# EAGLE board Main board V6.0 (EAGLE 6.5.0)
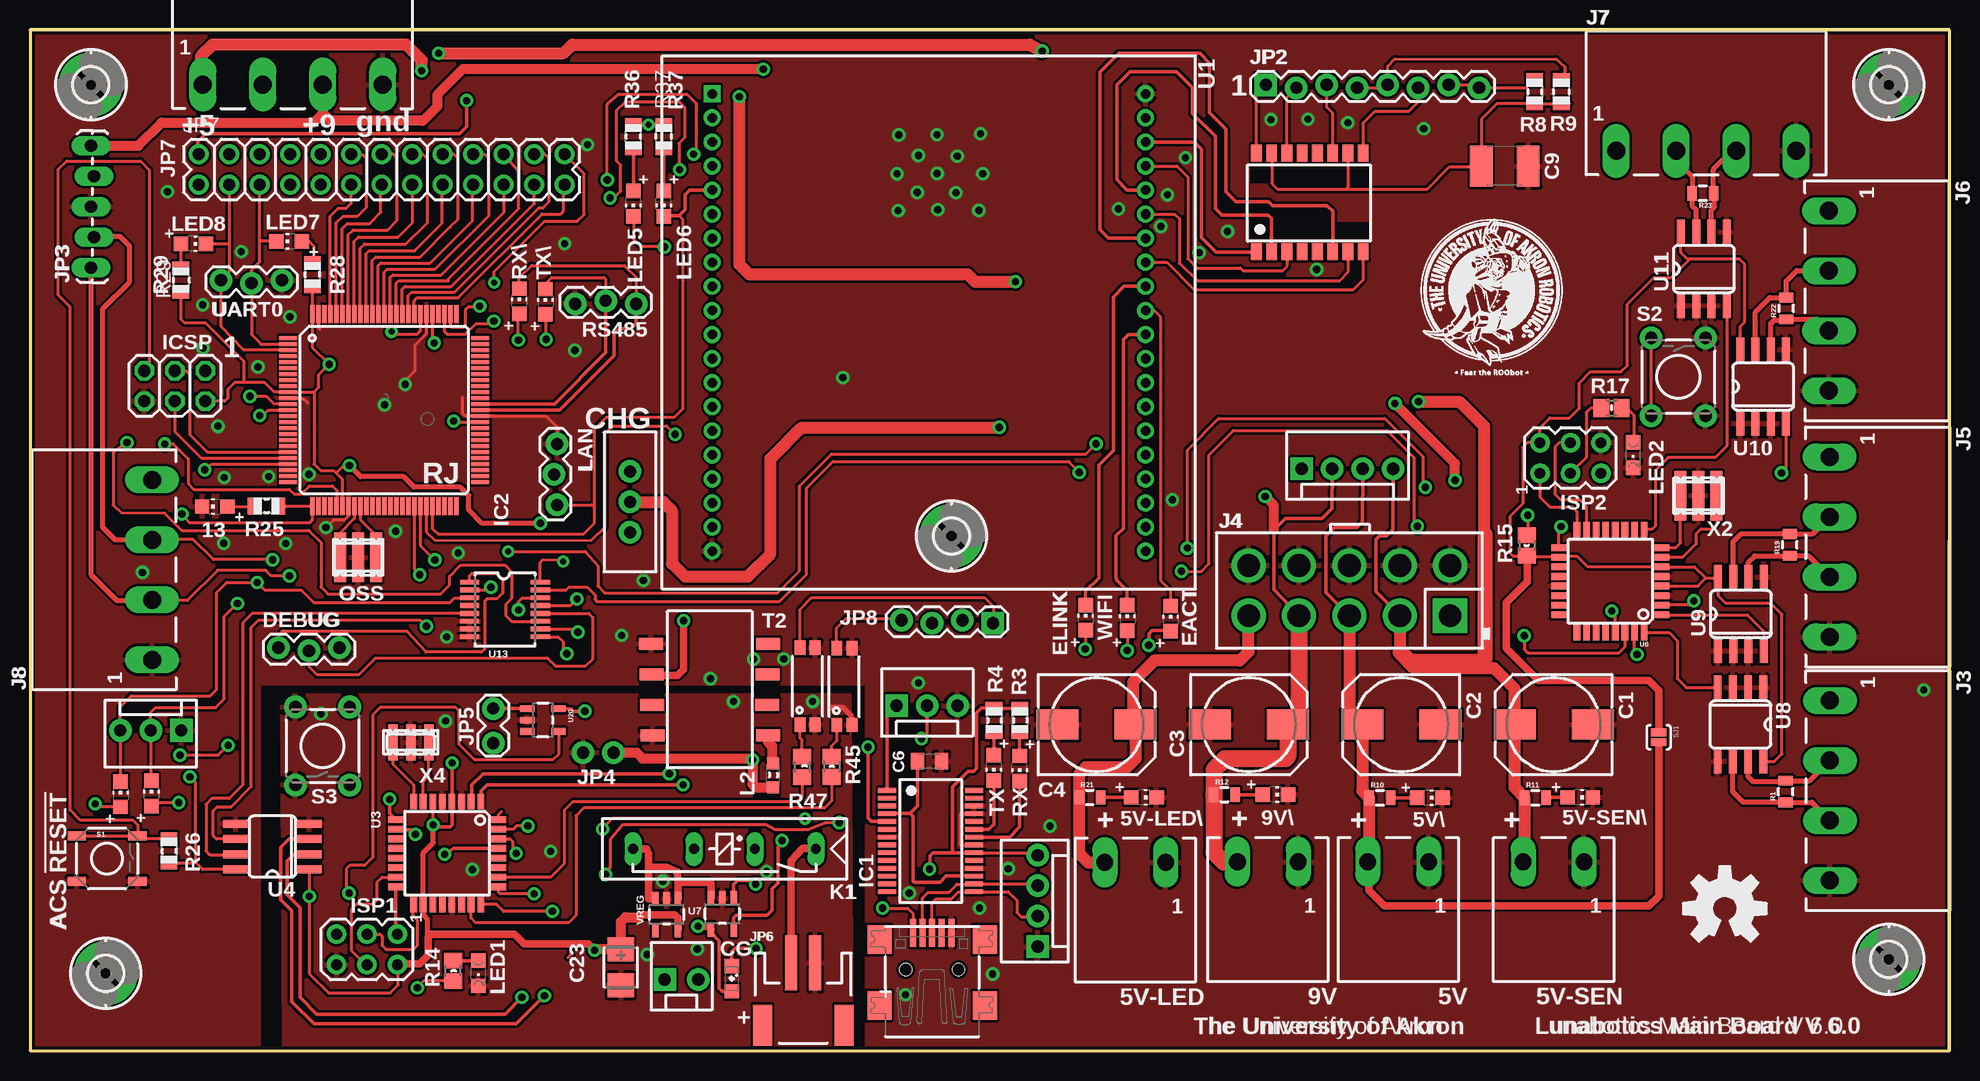
[diagram p5: board, top side]
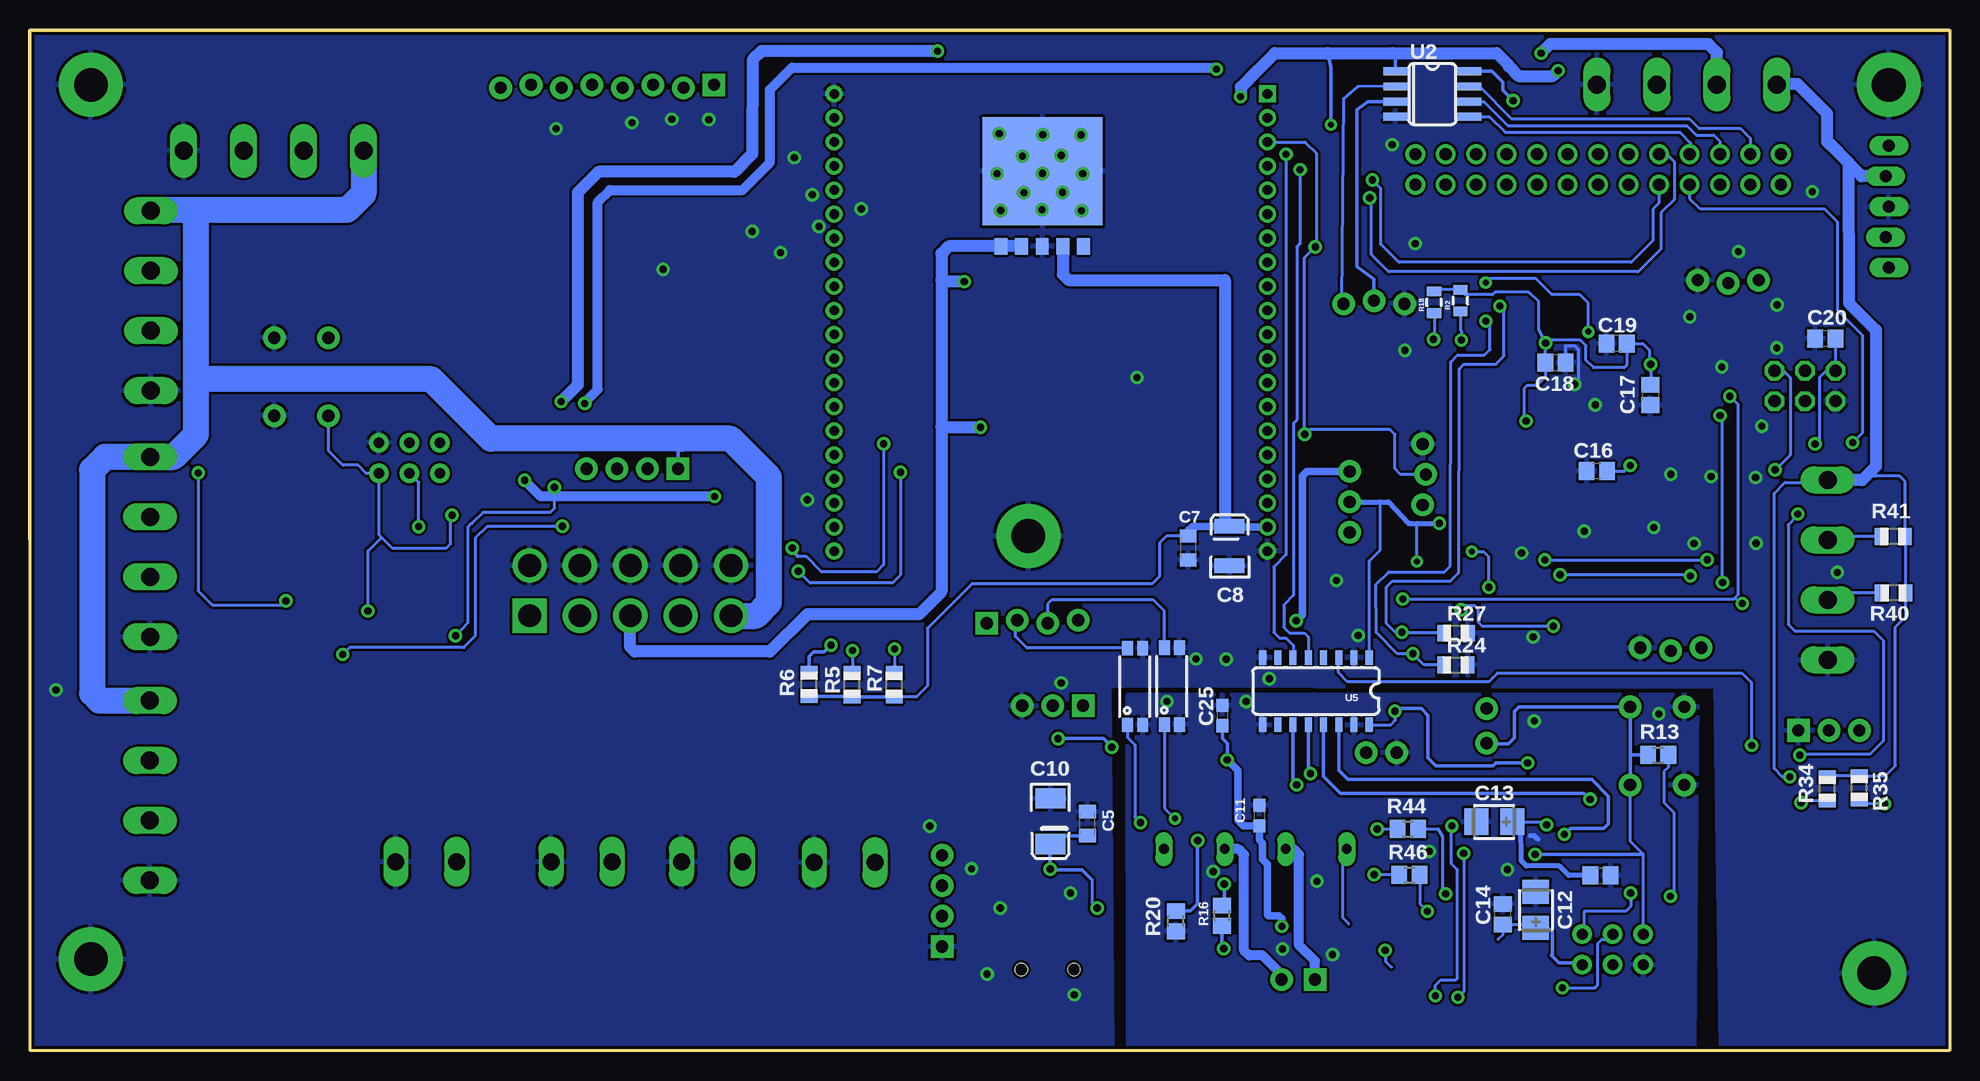
[diagram p6: board, bottom side, seen from below]

Size 160.02 x 85.09 mm. Coordinates in mm from the lower left corner, seen from the top.
Outline: 0,0 160,0 160.02,85.09 0,85.09 0,0
Copper layers (1*16): Top 0.035mm / dielectric 1.5mm / Bottom 0.035mm
Design rules "SparkFun": minimum track width 8mil, minimum drill 20mil, track to track 8mil, track to pad 8mil, pad to pad 8mil, via to via 8mil, smd to smd 8mil, copper to edge 10mil, drill to drill 8mil, minimum pad ring 12mil, minimum via ring 10mil, stop-mask expansion 4mil, vias tented up to drill 25mil, thermal gap 10mil
Net classes: 1 power: width 0.61 mm, drill 0.711 mm, clearance 0.203 mm

## Footprints (pad centres in the part's own frame; a part is rotated, then mirrored left to right if it is on the bottom)
M2 = drill 1.4 long: 1 -2.54,0; 2 2.54,0
CHIP-LED0805 = smd 1.2 x 1.2: A 0,-1.05; C 0,1.05
140CLH-0810 = smd 3.5 x 2.5: + 3.25,0; - -3.25,0
C0805K = smd 1.1 x 1.4: 1 -1,0; 2 1,0
EIA3528 = smd 1.2 x 2.5: A 1.65,0; C -1.65,0
C1812 = smd 1.9 x 3.4: 1 -1.95,0; 2 1.95,0
EIA3528-KIT = smd 1.7 x 2.5: A 1.9,0; C -1.9,0
C0603 = smd 1.1 x 1: 1 -0.85,0; 2 0.85,0
CT3528 = smd 2 x 2.2: + 1.5,0; - -1.5,0
C0805 = smd 1.3 x 1.5: 1 -0.85,0; 2 0.85,0
SML0805 = smd 1.2 x 1.2: A 1.05,0; C -1.05,0
SWITCH-SPDT = drill 1.016 pad 1.88: 1 0,2.54; 2 0,0; 3 0,-2.54
USB-MINIB = smd 0.5 x 2.308: D+ 0,4.064; D- -0.8,4.064; GND 1.6,4.064; ID 0.8,4.064; VBUS -1.6,4.064 | smd 2 x 2.4: GND1 -4.4,-2; GND2 -4.4,3.5; GND3 4.4,3.5; GND4 4.4,-2 | hole 1: -2.2,1; 2.2,1
1X03_LOCK = drill 1.016 pad 1.88: 1 0,0.127; 2 2.54,-0.127; 3 5.08,0.127
2,8-PAD = drill 2.8 pad 5.334: B2,8 0,0
SSOP28 = smd 0.4 x 1.5: 1 -4.225,-3.625; 2 -3.575,-3.625; 3 -2.925,-3.625; 4 -2.275,-3.625; 5 -1.625,-3.625; 6 -0.975,-3.625; 7 -0.325,-3.625; 8 0.325,-3.625; 9 0.975,-3.625; 10 1.625,-3.625; 11 2.275,-3.625; 12 2.925,-3.625; 13 3.575,-3.625; 14 4.225,-3.625; 15 4.225,3.625; 16 3.575,3.625; 17 2.925,3.625; 18 2.275,3.625; 19 1.625,3.625; 20 0.975,3.625; 21 0.325,3.625; 22 -0.325,3.625; 23 -0.975,3.625; 24 -1.625,3.625; 25 -2.275,3.625; 26 -2.925,3.625; 27 -3.575,3.625; 28 -4.225,3.625
TQFP100 = smd 1.5 x 0.35: 1 -8,6; 2 -8,5.5; 3 -8,5; 4 -8,4.5; 5 -8,4; 6 -8,3.5; 7 -8,3; 8 -8,2.5; 9 -8,2; 10 -8,1.5; 11 -8,1; 12 -8,0.5; 13 -8,0; 14 -8,-0.5; 15 -8,-1; 16 -8,-1.5; 17 -8,-2; 18 -8,-2.5; 19 -8,-3; 20 -8,-3.5; 21 -8,-4; 22 -8,-4.5; 23 -8,-5; 24 -8,-5.5; 25 -8,-6; 51 8,-6; 52 8,-5.5; 53 8,-5; 54 8,-4.5; 55 8,-4; 56 8,-3.5; 57 8,-3; 58 8,-2.5; 59 8,-2; 60 8,-1.5; 61 8,-1; 62 8,-0.5; 63 8,0; 64 8,0.5; 65 8,1; 66 8,1.5; 67 8,2; 68 8,2.5; 69 8,3; 70 8,3.5; 71 8,4; 72 8,4.5; 73 8,5; 74 8,5.5; 75 8,6 | smd 0.35 x 1.5: 26 -6,-8; 27 -5.5,-8; 28 -5,-8; 29 -4.5,-8; 30 -4,-8; 31 -3.5,-8; 32 -3,-8; 33 -2.5,-8; 34 -2,-8; 35 -1.5,-8; 36 -1,-8; 37 -0.5,-8; 38 0,-8; 39 0.5,-8; 40 1,-8; 41 1.5,-8; 42 2,-8; 43 2.5,-8; 44 3,-8; 45 3.5,-8; 46 4,-8; 47 4.5,-8; 48 5,-8; 49 5.5,-8; 50 6,-8; 76 6,8; 77 5.5,8; 78 5,8; 79 4.5,8; 80 4,8; 81 3.5,8; 82 3,8; 83 2.5,8; 84 2,8; 85 1.5,8; 86 1,8; 87 0.5,8; 88 0,8; 89 -0.5,8; 90 -1,8; 91 -1.5,8; 92 -2,8; 93 -2.5,8; 94 -3,8; 95 -3.5,8; 96 -4,8; 97 -4.5,8; 98 -5,8; 99 -5.5,8; 100 -6,8
2X03 = drill 1.016 octagon: 1 -2.54,-1.27; 2 -2.54,1.27; 3 0,-1.27; 4 0,1.27; 5 2.54,-1.27; 6 2.54,1.27
AVRISP = drill 0.9 pad 1.626: 1 -1.27,2.54; 2 1.27,2.54; 3 -1.27,0; 4 1.27,0; 5 -1.27,-2.54; 6 1.27,-2.54
M4 = drill 1.5 long: 1 0,0; 2 5,0; 3 10,0; 4 15,0
0874271042 = drill 1.9 square: 1 8.4,-2.1 | drill 1.9: 2 4.2,-2.1; 3 0,-2.1; 4 -4.2,-2.1; 5 -8.4,-2.1; 6 8.4,2.1; 7 4.2,2.1; 8 0,2.1; 9 -4.2,2.1; 10 -8.4,2.1
MOLEX-1X3 = drill 1.016 pad 1.88 square: 1 0,0 | drill 1.016 pad 1.88: 2 2.54,0; 3 5.08,0
1X08_LOCK = drill 1.016 pad 1.88 square: 1 0,0.127 | drill 1.016 pad 1.88: 2 2.54,-0.127; 3 5.08,0.127; 4 7.62,-0.127; 5 10.16,0.127; 6 12.7,-0.127; 7 15.24,0.127; 8 17.78,-0.127
1X05_LOCK_LONGPADS = drill 1.016 long: 1 0,0; 2 2.54,-0.254; 3 5.08,0; 4 7.62,-0.254; 5 10.16,0
1X02_NO_SILK = drill 1.016 pad 1.88: 1 0,0; 2 2.54,0
1X02_LOCK = drill 1.016 pad 1.88: 1 -0.178,0; 2 2.718,0
JST-2-SMD = smd 1 x 4.6: 1 -1,-3.7; 2 1,-3.7 | smd 1.6 x 3.4: NC1 -3.4,1.5; NC2 3.4,1.5
2X13 = drill 1.016 pad 1.651: 1 0,0; 2 0,2.54; 3 2.54,0; 4 2.54,2.54; 5 5.08,0; 6 5.08,2.54; 7 7.62,0; 8 7.62,2.54; 9 10.16,0; 10 10.16,2.54; 11 12.7,0; 12 12.7,2.54; 13 15.24,0; 14 15.24,2.54; 15 17.78,0; 16 17.78,2.54; 17 20.32,0; 18 20.32,2.54; 19 22.86,0; 20 22.86,2.54; 21 25.4,0; 22 25.4,2.54; 23 27.94,0; 24 27.94,2.54; 25 30.48,0; 26 30.48,2.54
1X04_LOCK = drill 1.016 pad 1.88 square: 1 0,0.127 | drill 1.016 pad 1.88: 2 2.54,-0.127; 3 5.08,0.127; 4 7.62,-0.127
MOLEX-1X4 = drill 1.016 pad 1.88 square: 1 0,0 | drill 1.016 pad 1.88: 2 2.54,0; 3 5.08,0; 4 7.62,0
MOLEX-1X2_LOCK = drill 1.016 pad 1.88 square: 1 -0.127,0 | drill 1.016 pad 1.88: 2 2.667,0
REED = drill 0.813 long: 1 -17.78,2.54; 3 -12.7,2.54; 5 -7.62,2.54; 7 -2.54,2.54
L2012C = smd 1 x 1: 1 -1,0; 2 1,0
CHIPLED_0805 = smd 1.2 x 1.2: A 0,-1.05; C 0,1.05
AWCSR = smd 1 x 4.1: 1 -1.5,0; 2 0,0; 3 1.5,0
0805 = smd 0.8 x 1.2: 1 -0.9,0; 2 0.9,0
R0805 = smd 1.1 x 1.4: 1 -1,0; 2 1,0
R0805' = smd 1.3 x 1.5: 1 -0.85,0; 2 0.85,0
TACTILE_SWITCH_SMD = smd 1.524 x 0.762: 1 -2.54,1.905; 2 2.54,1.905; 3 -2.54,-1.905; 4 2.54,-1.905
TACTILE-PTH = drill 1.016 pad 1.88: 1 -3.251,2.261; 2 3.251,2.261; 3 -3.251,-2.261; 4 3.251,-2.261
SJ_2S-NOTRACE = smd 0.635 x 1.27: 1 -0.401,0; 2 0.413,0
SO-8FT = smd 1 x 2: 1 -3.81,-4.91; 3 -1.27,-4.88; 5 1.27,-4.85; 7 3.81,-4.81; 8 3.81,4.81; 10 1.27,4.75; 12 -1.27,4.78; 14 -3.81,4.81
LANA/BTH = drill 0.8 square: 1 -18.059,19.063 | drill 0.8: 2 18.059,19.063; 3 -18.059,17.056; 4 18.059,17.056; 5 -18.059,15.05; 6 18.059,15.05; 7 -18.059,13.043; 8 18.059,13.043; 9 -18.059,11.036; 10 18.059,11.036; 11 -18.059,9.03; 12 18.059,9.03; 13 -18.059,7.023; 14 18.059,7.023; 15 -18.059,5.016; 16 18.059,5.016; 17 -18.059,3.01; 18 18.059,3.01; 19 -18.059,1.003; 20 18.059,1.003; 21 -18.059,-1.003; 22 18.059,-1.003; 23 -18.059,-3.01; 24 18.059,-3.01; 25 -18.059,-5.016; 26 18.059,-5.016; 27 -18.059,-7.023; 28 18.059,-7.023; 29 -18.059,-9.03; 30 18.059,-9.03; 31 -18.059,-11.036; 32 18.059,-11.036; 33 -18.059,-13.043; 34 18.059,-13.043; 35 -18.059,-15.05; 36 18.059,-15.05; 37 -18.059,-17.056; 38 18.059,-17.056; 39 -18.059,-19.063; 40 18.059,-19.063
SO08 = smd 0.66 x 2.032: 1 -1.905,-3.073; 2 -0.635,-3.073; 3 0.635,-3.073; 4 1.905,-3.073; 5 1.905,3.073; 6 0.635,3.073; 7 -0.635,3.073; 8 -1.905,3.073
TQFP32-08 = smd 1.27 x 0.559: 1 -4.293,2.8; 2 -4.293,2; 3 -4.293,1.2; 4 -4.293,0.4; 5 -4.293,-0.4; 6 -4.293,-1.2; 7 -4.293,-2; 8 -4.293,-2.8; 17 4.293,-2.8; 18 4.293,-2; 19 4.293,-1.2; 20 4.293,-0.4; 21 4.293,0.4; 22 4.293,1.2; 23 4.293,2; 24 4.293,2.8 | smd 0.559 x 1.27: 9 -2.8,-4.293; 10 -2,-4.293; 11 -1.2,-4.293; 12 -0.4,-4.293; 13 0.4,-4.293; 14 1.2,-4.293; 15 2,-4.293; 16 2.8,-4.293; 25 2.8,4.293; 26 2,4.293; 27 1.2,4.293; 28 0.4,4.293; 29 -0.4,4.293; 30 -1.2,4.293; 31 -2,4.293; 32 -2.8,4.293
SOIC-8 = smd 0.66 x 2.032: 1 -1.905,-3.073; 2 -0.635,-3.073; 3 0.635,-3.073; 4 1.905,-3.073; 5 1.905,3.073; 6 0.635,3.073; 7 -0.635,3.073; 8 -1.905,3.073
S016 = smd 0.6 x 1.2: 1 -4.445,-2.8; 2 -3.175,-2.8; 3 -1.905,-2.8; 4 -0.635,-2.8; 5 0.635,-2.8; 6 1.905,-2.8; 7 3.175,-2.8; 8 4.445,-2.8; 9 4.445,2.8; 10 3.175,2.8; 11 1.905,2.8; 12 0.635,2.8; 13 -0.635,2.8; 14 -1.905,2.8; 15 -3.175,2.8; 16 -4.445,2.8
SOT23-5 = smd 0.55 x 1.2: 1 -0.95,-1.3; 2 0,-1.3; 3 0.95,-1.3; 4 0.95,1.3; 5 -0.95,1.3
HRP5 = smd 1.07 x 1.37: 1 -3.44,0; 2 -1.72,0; 3 0,0; 4 1.72,0; 5 3.44,0 | smd 10 x 9: G 0,6.254
TSSOP-16 = smd 0.4 x 1.6: 1 -2.225,-2.85; 2 -1.575,-2.85; 3 -0.925,-2.85; 4 -0.275,-2.85; 5 0.375,-2.85; 6 1.025,-2.85; 7 1.675,-2.85; 8 2.325,-2.85; 9 2.325,3.05; 10 1.675,3.05; 11 1.025,3.05; 12 0.375,3.05; 13 -0.275,3.05; 14 -0.925,3.05; 15 -1.575,3.05; 16 -2.225,3.05
SOT23-5L = smd 0.55 x 1.2: 1 -0.95,-1.3; 2 0,-1.3; 3 0.95,-1.3; 4 0.95,1.3; 5 -0.95,1.3
SSOP-4 = smd 1.2 x 0.9: 1 -3.2,0.67; 2 -3.2,-0.6; 3 3.2,-0.6; 4 3.2,0.67
SO-16MOD = smd 1.4 x 0.9: 1 -4.11,4.445; 2 -4.11,3.175; 3 -4.11,1.905; 4 -4.11,0.635; 5 -4.11,-0.635; 6 -4.11,-1.905; 7 -4.11,-3.175; 8 -4.11,-4.445; 9 4.11,-4.445; 10 4.11,-3.175; 11 4.11,-1.905; 12 4.11,-0.635; 13 4.11,0.635; 14 4.11,1.905; 15 4.11,3.175; 16 4.11,4.445
CSTCR-G = smd 0.8 x 3: 1 -1.5,0; 2 0,0; 3 1.5,0

## Placement (x,y rotation side)
5V  [M2]  114.05,15.75 180 top
5V-LED  [M2]  92.13,15.7 180 top
5V-LED\  [CHIP-LED0805]  92.85,21.11 270 top
5V-SEN  [M2]  127,15.75 180 top
5V-SEN\  [CHIP-LED0805]  129.22,21.11 270 top
5V\  [CHIP-LED0805]  116.69,21.08 270 top
9V  [M2]  103.17,15.75 180 top
9V\  [CHIP-LED0805]  103.81,21.34 270 top
13  [CHIP-LED0805]  15.41,45.36 90 top
C1  330uF  [140CLH-0810]  127,27.18 180 top
C2  330uF  [140CLH-0810]  114.3,27.18 180 top
C3  330uf  [140CLH-0810]  101.6,27.18 0 top
C4  330uF  [140CLH-0810]  88.9,27.18 0 top
C5  0.1uF  [C0805K]  71.88,18.92 90 bottom
C6  0.1uF  [C0805K]  74.98,24.13 0 top
C7  0.1uf  [C0805K]  63.47,41.91 270 bottom
C8  10uf  [EIA3528]  60.02,42.06 90 bottom
C9  1000pF  [C1812]  122.93,73.74 180 top
C10  10uF  [EIA3528-KIT]  74.96,19.13 270 bottom
C11  4.7uF  [C0603]  57.53,19.58 90 bottom
C12  10uF  [CT3528]  34.51,11.72 270 bottom
C13  0.1uF  [CT3528]  37.97,19.08 0 bottom
C14  0.1uF  [C0805]  37.26,11.37 90 bottom
C15  0.1uF  [C0805]  29.11,14.59 0 bottom
C16  100n  [C0805]  29.41,48.3 180 bottom
C17  100n  [C0805]  24.95,54.67 270 bottom
C18  100n  [C0805]  32.85,57.35 0 bottom
C19  100n  [C0805]  27.77,58.95 180 bottom
C20  22p  [C0805]  10.37,59.34 180 bottom
C23  10uF  [CT3528]  49.25,6.93 90 top
C25  4.7uF  [C0603]  60.6,27.94 90 bottom
CG  RED  [SML0805]  58.5,5.99 270 top
CHG  [SWITCH-SPDT]  50.01,45.75 180 top
CN1  [USB-MINIB]  75.2,5.76 0 top
DEBUG  [1X03_LOCK]  20.71,33.46 0 top
EACT  [CHIP-LED0805]  95.07,36.02 0 top
ELINK  [CHIP-LED0805]  87.99,36.09 0 top
H2  MOUNT-PAD-ROUND2.8  [2,8-PAD]  154.94,7.62 0 top
H4  MOUNT-PAD-ROUND2.8  [2,8-PAD]  76.81,42.9 0 top
H5  MOUNT-PAD-ROUND2.8  [2,8-PAD]  5.08,80.52 0 top
H6  MOUNT-PAD-ROUND2.8  [2,8-PAD]  154.94,80.52 0 top
H10  MOUNT-PAD-ROUND2.8  [2,8-PAD]  6.3,6.45 0 top
IC1  FT232RL  [SSOP28]  75.08,17.48 270 top
IC2  ATMEGA1280-16AU  [TQFP100]  29.53,53.41 0 top
ICSP  ICSP  [2X03]  12.07,55.41 180 top
ISP1  AVRISP-6  [AVRISP]  28.09,8.43 270 top
ISP2  AVRISP-6  [AVRISP]  128.4,49.41 90 top
J1  EUROMAG-4  [M4]  14.42,80.54 0 top
J3  LED1  [M4]  150.04,29.19 270 top
J4  0874271042  [0874271042]  109.98,38.35 0 top
J5  LED1  [M4]  150.01,49.5 270 top
J6  LED1  [M4]  149.95,70.02 270 top
J7  LED1  [M4]  132.22,75.03 0 top
J8  EUROMAG-4  [M4]  10.19,32.57 90 top
JP1  [MOLEX-1X3]  72.24,28.75 0 top
JP2  [1X08_LOCK]  103.01,80.4 0 top
JP3  [1X05_LOCK_LONGPADS]  5.08,65.28 90 top
JP4  [1X02_NO_SILK]  48.64,24.84 180 top
JP5  [1X02_LOCK]  38.61,28.35 270 top
JP6  [JST-2-SMD]  64.45,3.62 180 top
JP7  M13X22X13  [2X13]  14.07,72.19 0 top
JP8  [1X04_LOCK]  80.27,35.76 180 top
JP10  [MOLEX-1X4]  83.99,8.67 90 top
JP11  [MOLEX-1X4]  106.01,48.5 0 top
JP12  [MOLEX-1X2_LOCK]  53.04,5.92 0 top
K1  SIL24-1A72-71L  [REED]  47.73,19.35 180 top
L2  47uH  [L2012C]  61.93,22.96 90 top
LAN  [1X03_LOCK]  43.8,50.58 270 top
LED1  [CHIPLED_0805]  37.36,6.45 180 top
LED2  [CHIPLED_0805]  133.63,49.65 180 top
LED3  RED  [CHIP-LED0805]  10.12,21.44 0 top
LED4  GREEN  [CHIP-LED0805]  7.55,21.37 0 top
LED5  RED  [CHIP-LED0805]  50.29,70.61 180 top
LED6  GREEN  [CHIP-LED0805]  52.83,70.61 180 top
LED7  RED  [CHIP-LED0805]  21.6,67.47 90 top
LED8  GREEN  [CHIP-LED0805]  13.63,67.27 270 top
OSS  16Mhz  [AWCSR]  27.35,41.13 0 top
R1  [0805]  146.34,21.6 90 top
R2  1k  [0805]  40.79,62.53 90 bottom
R3  1K  [R0805]  82.5,27.53 270 top
R4  1K  [R0805]  80.37,27.53 270 top
R5  182  [R0805]  91.49,30.51 90 bottom
R6  182  [R0805]  95.07,30.53 90 bottom
R7  182  [R0805]  87.99,30.51 90 bottom
R8  75  [R0805]  125.41,79.95 270 top
R9  75  [R0805]  127.64,79.95 270 top
R10  1k  [0805]  112.52,21.08 0 top
R11  330  [0805]  125.48,21.08 0 top
R12  1k  [0805]  99.57,21.34 0 top
R13  10k  [R0805']  24.31,24.64 0 bottom
R14  330  [R0805']  35.28,6.65 90 top
R15  10k  [R0805']  124.77,42.11 270 top
R16  330  [R0805']  60.66,11.25 90 bottom
R17  330  [R0805']  131.83,53.56 0 top
R18  1k  [0805]  42.98,62.39 90 bottom
R19  [0805]  146.69,42.17 90 top
R20  10k  [R0805']  64.52,10.8 90 bottom
R21  2k  [0805]  88.34,21.11 0 top
R22  [0805]  146.39,61.88 90 top
R23  [0805]  139.43,71.47 180 top
R24  2k  [R0805]  41.17,32.16 0 bottom
R25  1k  [R0805]  19.71,45.4 180 top
R26  10k  [R0805]  11.58,16.66 270 top
R27  2k  [R0805]  41.15,34.8 0 bottom
R28  1k  [R0805]  23.53,64.69 270 top
R29  1k  [R0805]  12.57,64.23 270 top
R34  1k  [R0805]  10.2,21.83 90 bottom
R35  1k  [R0805]  7.54,21.89 90 bottom
R36  1k  [R0805]  50.29,76.2 90 top
R37  1k  [R0805]  52.83,76.2 90 top
R40  2k  [R0805]  4.68,38.16 180 bottom
R41  2k  [R0805]  4.72,42.86 180 bottom
R44  499  [R0805']  45.16,18.49 0 bottom
R45  499  [R0805']  66.83,23.67 270 top
R46  499  [R0805']  45.03,14.66 0 bottom
R47  499  [R0805']  64.36,23.65 270 top
RS485  [1X03_LOCK]  50.53,62.39 180 top
RX  Green  [CHIP-LED0805]  82.5,23.52 180 top
RX\  [CHIP-LED0805]  40.78,62.48 0 top
S1  [TACTILE_SWITCH_SMD]  6.43,16.01 0 top
S2  [TACTILE-PTH]  137.4,56.18 270 top
S3  [TACTILE-PTH]  24.38,25.4 90 top
SJ1  SOLDERJUMPERNC2  [SJ_2S-NOTRACE]  135.75,26.13 270 top
T2  NTE0505MC  [SO-8FT]  56.69,30.1 270 top
TX  Red  [CHIP-LED0805]  80.34,23.57 180 top
TX\  [CHIP-LED0805]  42.97,62.44 0 top
U1  LANTRONIX_B/G  [LANA/BTH]  74.93,60.71 0 top
U2  ISL83077  [SO08]  43.12,79.75 270 bottom
U3  ATMEGA328  [TQFP32-08]  34.77,16.46 270 top
U4  ISO7221ADR  [SOIC-8]  20.21,17.01 90 top
U5  IL715  [S016]  52.83,29.97 180 bottom
U6  ATMEGA328  [TQFP32-08]  131.74,39.14 180 top
U7  MCP73831  [SOT23-5]  57.71,11.4 180 top
U8  MAX485SO  [SO08]  142.57,27.18 180 top
U9  MAX485SO  [SO08]  142.61,36.4 0 top
U10  MAX485SO  [SO08]  144.46,55.37 0 top
U11  MAX485SO  [SO08]  139.52,65.17 0 top
U12  BA50DD0WHFP-TR  [HRP5]  75.64,67.05 0 bottom
U13  CD74HC4052PWR  [TSSOP-16]  39.49,36.82 270 top
U20  MAX823  [SOT23-5L]  42.75,27.56 270 top
U$3  OSHW-LOGOL  [OSHW-LOGO-L]  141.27,11.85 0 top
U$16  TCMT1103-OPTO  [SSOP-4]  67.92,30.35 90 top
U$17  TCMT1103-OPTO  [SSOP-4]  64.85,30.38 90 top
U$18  TCMT1103-OPTO  [SSOP-4]  64.8,30.38 90 bottom
U$19  TCMT1103-OPTO  [SSOP-4]  67.87,30.35 90 bottom
UART0  [1X03_LOCK]  15.92,64.1 0 top
UART2  [MOLEX-1X3]  12.61,26.7 180 top
VREG  MIC5205-3.3V  [SOT23-5]  53.06,11.35 180 top
WIFI  [CHIP-LED0805]  91.47,36.07 0 top
X1  TLA-6T118LF  [SO-16MOD]  106.68,70.71 90 top
X2  [AWCSR]  139.08,46.26 180 top
X4  [CSTCR-G]  31.74,25.7 180 top

## Tracks (layer width: path | path; a pad name or v marks a point on that pad's centre or on a via)
5V  (via drill 0.5, 0.6)
  Top 0.254: 23.68,54.91 IC2.10 20.34,54.91 19.55,55.71 17.74,55.71 | 23.68,54.91 24.07,55.3 24.07,56.36 v24.93,57.22 23.54,58.62 IC2.100 R28.2 | v33.69,59 33.54,59.46 IC2.80 | v35.32,52.48 35.79,52.48 35.87,52.41 IC2.61 | U4.8 14.38,15.11 13.81,15.68 13.81,15.77 | 13.81,15.77 13.81,22.35 v13.34,22.82 | U13.16 42.54,40.67 42.79,40.93 44.3,40.91 v44.43,40.79 | 17.74,55.71 17.07,55.71 16.49,55.12 16.49,54.39 16.23,54.13 ICSP.2 | R26.2 13.7,15.66 13.81,15.77 | 23.68,54.91 23.68,48.9 24.23,48.34 25.33,48.34 25.52,48.15 | 25.52,48.15 26.01,47.66 26.01,45.44 IC2.31 | v26.63,48.77 26.15,48.77 25.52,48.15 | R29.2 12.57,60.97 12.87,60.67 14.61,60.67 17.81,57.47 17.81,55.77 17.74,55.71
  Top 0.305: JP11.3 111.07,44.07 110.62,43.61 108.74,43.61 108.03,42.9 108.03,38.21 J4.3 | R36.2 52.54,77.17 v51.58,77.21
  Top 0.406: R36.2 R37.2 | v42.53,43.96 37.7,43.96 36.56,45.09 36.56,46.29 35.88,46.97 32.02,46.97 31.13,47.86 27.55,47.86 v26.63,48.77
  Top 0.61: SJ1.2 135.75,12.86 134.95,12.06 112.89,12.06 111.58,13.37 111.58,15.67 5V.2
  Top 1.016: J4.3 109.98,28.25 C2.+ 111.05,21.65 R10.1 111.62,15.86 5V.2 | CHG.2 52.79,45.75 53.52,45.02 53.52,40.61 54.61,39.52 59.83,39.52 61.72,41.41 61.72,49.33 64.31,51.92 80.75,51.92 v80.79,51.96 | v59.12,79.53 59.12,65.56 59.96,64.73 78.16,64.73 78.78,64.1 82.13,64.1 v82.15,64.12 | v32.65,81.69 32.65,82.57 31.35,83.88 15.22,83.88 14.24,82.9 14.24,80.72 J1.1
  Bottom 0.254: 10.21,75.75 10.01,75.55 | C17.1 24.93,55.54 v24.93,57.22 25.06,57.35 25.06,58.41 25.59,58.95 C19.1 26.92,57.16 27.15,56.93 29.68,56.93 30.32,57.56 30.32,58.77 30.8,59.25 33.44,59.25 v33.69,59 | v33.69,59 33.71,59.29 C18.1 33.71,56.14 34.42,55.43 35.23,55.43 35.49,55.18 35.49,52.65 v35.32,52.48 | v33.69,59 34.28,60.09 34.28,62.48 35.09,63.23 37.91,63.23 38.11,63.02 40.39,63.02 R2.2 42.84,63.43 R18.2 | R34.2 10.13,22.9 R35.2 5.38,22.9 4.52,23.76 4.52,35.34 3.67,36.19 R40.1 3.68,42.82 R41.1 3.72,47.43 4.18,47.89 6.22,47.89 6.6,48.26 | v13.34,22.82 13.95,22.82 14.64,23.51 14.64,46.45 13.73,47.37 11,47.37 10.71,47.66 10.27,47.66 J8.4 | U5.1 48.39,40.84 47.47,41.75 47.47,45.68 47.54,45.75 | C16.1 27.1,48.3 v26.63,48.77 | v44.43,40.79 44.41,44.04 44.93,43.96
  Bottom 0.305: U2.1 46.19,82.93 46.42,83.15 | v51.58,77.21 51.59,81.95 51.84,83.15
  Bottom 0.406: CHG.2 47.54,45.75 46.81,45.75 45.14,43.96 44.93,43.96 v42.53,43.96
  Bottom 1.016: JP3.4 7.35,72.9 10.05,75.6 | 10.05,75.6 10.12,75.67 | U12.2 U12.1 83.45,67.05 84.05,66.45 84.05,64.21 | 84.05,64.21 84.05,52.01 | 84.05,52.01 84.05,38.25 85.92,36.38 95.23,36.38 98.34,33.27 109.61,33.27 109.98,33.64 J4.3 | 10.01,75.55 10.05,75.64 | 10.05,75.64 8.45,74.04 8.41,62.33 6.16,60.08 6.16,48.7 6.6,48.26 7.3,47.56 10.17,47.56 J8.4 | 10.21,75.75 10.21,78.12 12.68,80.59 14.37,80.59 J1.1 | v80.79,51.96 84,51.96 84.05,52.01 | v59.12,79.53 59.09,79.56 59.09,80.33 57.77,81.66 57.76,81.66 56.26,83.15 51.84,83.15 46.42,83.15 37.76,83.15 36.77,82.16 36.77,82.06 35.96,81.25 33.1,81.25 v32.65,81.69 | v82.15,64.12 83.96,64.12 84.05,64.21 | 10.05,75.64 10.05,75.6
5V-LED
  Top 0.305: 101.55,36.22 J4.5
  Top 1.016: J4.5 101.58,33.26 100.84,32.51 93.73,32.51 91.95,30.73 91.95,27.38 C4.+ 92.15,24.33 91.44,23.62 88.01,23.62 87.44,23.06 R21.1 | R21.1 | R21.1 87.44,16.45 88.2,15.69 5V-LED.2
  Bottom 0.305: JP11.1 105.99,50.71 105.68,51.02
  Bottom 2.184: J7.1 132.22,71.44 133.59,70.07 146.28,70.07 | 146.28,70.07 149.9,70.07 J6.1 | 146.18,55.85 146.18,51.37 148.05,49.5 J5.1 153.76,49.5 154.85,48.41 154.85,29.8 154.23,29.18 150.05,29.18 J3.1 | 146.18,55.85 146.18,69.97 146.28,70.07 | J4.5 99.52,36.25 98.43,37.34 98.43,47.81 101.64,51.02 105.68,51.02 121.62,51.02 126.57,55.98 146.05,55.98 146.18,55.85
5V-LEDEN
  Bottom 0.254: U$19.4 76.91,33.55 77.88,34.53 77.88,35.73 JP8.2
5V-SEN  (via drill 0.6)
  Top 0.305: JP11.4 113.61,43.45 113.07,42.91 112.46,42.91 112.17,42.62 112.17,38.27 J4.2
  Top 1.016: J4.2 114.23,36.21 114.23,33.22 114.23,33.01 115.37,31.87 122.05,31.87 123.75,30.17 C1.+ 123.75,21.91 R11.1 124.58,15.86 5V-SEN.2 | v34.06,83.15 44.48,83.15 45.2,83.88 83.33,83.88 v84.37,83.33 | v115.75,54.11 119.14,54.11 121.2,52.05 121.2,43.12 121.27,43.05
  Top 1.27: 121.27,43.05 121.27,32.7 121.01,32.43 115.01,32.43 114.23,33.22
  Bottom 1.016: J1.2 19.42,83.2 20.12,83.9 33.31,83.9 v34.06,83.15 | v84.37,83.33 99.05,83.33 99.79,82.59 99.82,74.76 101.31,73.27 112.63,73.27 114.37,71.53 114.37,55.49 v115.75,54.11
5V-SENEN
  Top 0.254: U$16.4 67.25,35.25 68.01,36.01 72.52,36.01 JP8.4
5VEN
  Bottom 0.254: U$18.4 65.47,36.65 66.38,37.57 74.86,37.57 75.2,37.23 75.2,35.64 JP8.3
9VEN
  Top 0.254: U$17.4 64.18,36.78 65.17,37.76 79.58,37.76 80.33,37.01 80.33,35.69 JP8.1
!RESET  (via drill 0.6)
  Top 0.254: v11.23,50.58 11.95,50.58 13.2,49.33 13.2,47.26 13.67,46.79 21.62,46.79 22.02,46.39 22.62,46.39 23.31,47.07 25.2,47.07 25.55,46.72 25.55,45.43 IC2.30 | S1.1 S1.2 9.22,17.66 R26.1 9.44,17.66 9.03,18.07 9.03,18.76 8.59,19.21 4.21,19.21 3.35,20.06 3.35,62 2.36,62.99 2.36,73.48 3.05,74.16 9.21,74.16 9.96,73.41 9.96,57.11 ICSP.5
  Bottom 0.254: C20.1 ICSP.5 10.31,56.68 10.86,56.13 10.86,50.95 v11.23,50.58
!REST  (via drill 0.6)
  Top 0.254: S2.4 S2.3 | v124.84,44.63 124.84,43.03 R15.1 | U6.29 132.14,36.37 v131.85,36.66
  Bottom 0.254: 130.72,42.79 130.94,43.01 ISP2.5 130.96,48.17 132.03,48.17 132.67,48.8 133.95,48.8 135.14,49.99 S2.4 | 130.72,42.79 129.83,41.9 125.3,41.9 125.3,41.92 124.96,42.26 124.96,44.52 v124.84,44.63 | v131.85,36.66 131.85,41.66 130.72,42.79
+3V3
  Bottom 0.254: 91.52,29.53 R5.1 | C7.1 65.29,42.91 65.86,42.34 65.86,39.54 66.49,38.92 81.51,38.92 85.22,35.21 85.22,30.4 86.13,29.48 87.96,29.48 R7.1
  Bottom 0.305: R7.1 R5.1 | 91.52,29.53 R6.1
  Bottom 0.61: U1.37 59.96,43.65 C8.A 63.12,43.71 63.45,43.38 63.45,42.94 C7.1
  Bottom 1.016: C8.A 60.43,44.12 60.43,64.24 73.47,64.24 73.92,64.7 U12.4
+5V
  Top 0.254: U6.4 139.03,38.74 139.69,39.39 | 139.69,39.39 140.62,39.39 U9.8 140.73,39.45 140.73,37.9 141.35,37.28 145.12,37.28 146.03,36.38 146.03,24.72 145.42,24.11 U8.8 | 139.69,39.39 138.74,40.34 U6.6 129.84,40.34 128.98,41.19 127.5,41.19 U6.18 124.89,41.14 R15.2 124.75,41.24 123.62,41.24 123.37,41.5 123.37,44.53 124.44,45.6 124.44,50.31 124.8,50.68 ISP2.2 125.86,51.91 126.68,52.74 128.32,52.74 129.15,53.56 129.15,55.67 130.07,56.6 132.61,56.6 133.15,57.13 133.15,62.24 135.36,64.45 136.81,64.45 138.36,66 | U10.8 142.56,60.36 142.93,60.73 142.93,65.56 142.5,66 138.36,66 | 138.36,66 138.15,66 137.62,66.53 U11.8
  Top 0.61: SJ1.1 135.75,30.03 134.94,30.84 125.73,30.84 123.05,33.52 123.05,37.34 124.82,39.11 124.82,41.21 R15.2
+9V  (via drill 0.6)
  Top 0.254: 98.6,21.4 R12.1
  Top 0.305: JP11.2 108.53,45.21 107.7,44.37 104.65,44.37 103.68,43.41 103.68,38.46 J4.4
  Top 0.813: JP3.5 9.04,75.44 10.96,77.36 23.65,77.36 24.42,78.14 | 24.42,78.14 J1.3 | 103.68,43.41 103.68,45.47 v102.96,46.2 | v118.78,47.54 118.78,48.95 v113.78,53.96 | v61.13,81.82 36.08,81.82 33.95,79.69 33.95,78.71 32.75,77.51 25.05,77.51 24.42,78.14
  Top 1.016: 100.62,15.74 9V.2
  Top 1.422: J4.4 105.78,28.11 C3.+ 104.85,24.54 104.65,24.33 99.59,24.33 98.69,23.44 98.69,21.36 R12.1 98.67,16.53 99.48,15.72 100.6,15.72 9V.2
  Bottom 0.813: v102.96,46.2 117.44,46.2 v118.78,47.54 | v113.78,53.96 113.78,54.05 112.7,55.12 112.7,70.73 111.69,71.75 100.62,71.75 98.34,74.04 98.34,80.12 97.73,80.73 97.72,80.73 96.5,81.95 61.25,81.95 v61.13,81.82
ADC0
  Top 0.254: IC2.97 25.04,69.58 25.68,70.23 26.35,70.23 26.77,70.64 JP7.11
ADC1
  Top 0.254: IC2.96 25.54,69.01 26.09,69.56 27.31,69.56 28.06,70.31 28.06,74.38 27.76,74.67 26.84,74.67 JP7.12
ADC2
  Top 0.254: IC2.95 26.04,68.53 26.46,68.96 28.31,68.96 29.24,69.88 29.24,72.12 JP7.13
ADC3
  Top 0.254: IC2.94 26.54,68.03 26.93,68.42 29.8,68.42 30.6,69.22 30.58,74.39 30.29,74.72 29.33,74.72 JP7.14
ADC4
  Top 0.254: IC2.93 27.04,67.48 27.38,67.82 30.68,67.82 31.89,69.03 31.89,72.16 JP7.15
ADC5
  Top 0.254: IC2.92 27.54,66.9 27.88,67.24 31.33,67.24 33.14,69.04 33.14,74.3 32.72,74.72 31.87,74.72 JP7.16
ADC6
  Top 0.254: IC2.91 28.04,66.45 28.28,66.69 32.07,66.69 34.34,68.97 34.34,72.14 JP7.17
ADC7
  Top 0.254: IC2.90 28.54,65.88 28.82,66.16 32.53,66.16 35.04,68.68 35.04,68.69 35.68,69.31 35.68,74.38 35.33,74.72 34.41,74.72 JP7.18
ADC8
  Top 0.254: IC2.89 29.04,65.45 29.24,65.65 33.34,65.65 36.9,69.21 36.9,72.16 JP7.19
ADC9
  Top 0.254: IC2.88 29.54,64.92 29.76,65.15 33.77,65.15 38.25,69.63 38.27,69.63 38.27,74.35 37.92,74.7 36.97,74.7 JP7.20
ADC10
  Top 0.254: IC2.87 30.04,64.44 30.25,64.66 34.29,64.66 39.51,69.88 39.51,72.16 JP7.21
ADC11
  Top 0.254: IC2.86 30.54,63.99 30.74,64.19 34.89,64.19 34.89,64.36 40.73,70.21 40.73,73.26 JP7.22
ADC12
  Top 0.254: IC2.85 31.04,63.49 31.24,63.7 35.12,63.7 42.03,70.61 42.03,72.18 JP7.23
ADC13
  Top 0.254: IC2.84 31.54,62.96 31.8,63.23 35.38,63.23 42.43,70.28 42.79,70.28 43.27,70.76 43.27,74.39 42.83,74.84 42.11,74.84 JP7.24
ADC14
  Top 0.254: IC2.83 32.04,62.55 32.25,62.76 35.69,62.76 42.69,69.76 44.21,69.76 44.46,70.01 44.46,72.1 JP7.25
ADC15  (via drill 0.5)
  Top 0.254: IC2.82 32.54,59.99 32.26,59.71 30.34,59.71 v30.13,59.93 | v38.69,64.04 38.69,64.94 42.88,69.13 45.62,69.13 46.19,69.7 46.19,73.1 JP7.26
  Bottom 0.254: v30.13,59.93 30.13,62.33 30.82,63.02 33.16,63.02 34.49,64.36 38.36,64.36 | 38.36,64.36 38.44,64.27 | 38.36,64.36 38.37,64.36 v38.69,64.04
AUTO13  (via drill 0.6)
  Top 0.254: v48.35,71.09 48.66,71.09 49.24,71.67 49.24,73.83 48.91,74.16 48.91,78.39 49.65,79.13 53.61,79.13 53.62,79.12 53.63,79.12 53.65,79.13 54.1,79.13 54.56,78.67 54.56,76.11 54.1,75.65 54.1,73.49 v54.15,73.44
  Bottom 0.254: JP7.10 23.6,74.73 22.96,74.1 22.96,70.96 24.08,69.84 24.08,66.83 25.97,64.94 46.78,64.94 48.21,66.38 48.21,70.95 v48.35,71.09 | v54.15,73.44 54.15,67.27 54.43,66.99 54.43,52.58 54.69,52.33 54.69,37.97 55.51,37.14 55.51,35.29 55.03,34.8 53.8,34.8 53.47,34.47 U5.5
D2
  Top 0.254: U3.32 39.07,19.71 39.29,19.94
DBUGRX
  Top 0.254: U13.12 46.57,36.45 46.9,36.11 46.9,33.38 46.93,33.36 46.93,32.67 46.31,32.05 43.8,32.05 43.16,32.7 28.75,32.7 27.4,31.34 23.93,31.34 23.28,31.99 23.28,33.31 DEBUG.2
DBUGTX
  Top 0.254: U13.1 36.64,39.59 36.84,39.8 38.9,39.8 39.4,39.3 39.4,38.14 38.91,37.66 38.1,37.66 37.91,37.47 37.91,33.48 37.64,33.22 33.01,33.22 31.45,34.96 21.01,34.96 20.65,34.42 20.65,33.65 DEBUG.1
DFDFD
  Top 0.254: ISP2.1 125.86,46.13 126.67,45.32 128.54,45.32 128.93,44.93 U6.16
ETHCONECT
  Top 0.305: U1.18 91.2,63.72 90.32,62.84 90.32,50.04 89.1,48.82 89.1,39.42 87.99,38.3 ELINK.C
FPIC  (via drill 0.6)
  Top 0.254: v8.09,50.69 7.96,50.65 6.92,49.92 6.94,45.5 7.62,44.85 11.2,44.84 12.66,43.38 23.23,43.38 24.26,42.35 24.26,39.61 | 24.26,39.61 24.25,39.59 | 24.26,39.61 24.26,38.64 24.84,38.06 34.22,38.06 34.98,38.82 34.98,39.54 35.9,40.47 39.59,40.47 40.13,39.92 40.13,37.69 39.65,37.21 39.65,36.27 40.15,35.77 42.51,35.77 U13.11
  Bottom 0.254: JP7.7 21.69,71.04 20.83,70.17 10.45,70.17 9.39,69.11 9.39,61.74 7.3,59.66 7.3,51.48 v8.09,50.69
GND  (via drill 0.6)
  Top 0.254: 78.72,19.73 77.54,19.73 77.54,17.15 IC1.21 | IC2.62 36.43,52.91 36.41,52.93 36.29,52.93 36.08,53.13 36.08,54.44 36.04,54.48 | IC2.11 22.61,54.41 22.72,54.3 22.85,54.3 23.14,54.01 | IC2.99 24.04,60.26 24.18,60.12 | IC2.32 26.54,44.57 26.2,44.24 25.3,44.24 v24.67,43.61 | IC2.81 33.04,61.29 33.01,61.26 33.01,59.73 32.11,58.83 32.11,56.7 31.27,55.86 v31.27,55.56 | 38.84,52.9 43.03,52.9 43.98,51.95 43.98,50.63 LAN.1
  Top 0.305: IC2.62 38.83,52.91 38.84,52.9
  Top 0.406: IC1.25 78.72,19.73 | 13.C 14.2,45.36 14.2,45.57
  Bottom 0.254: C5.2 71.88,19.74 71.97,19.65 71.97,19.68 71.69,19.96 | C18.2 32.01,58.72 32.06,58.77 31.26,58.77 30.94,58.45 30.94,55.89 v31.27,55.56
  other vias: 157.86,30.07 11.46,71.62 99.82,68.3 107.25,65.13 90.73,70.18 96.32,74.45 94.82,71.35 97.46,66.52 94.26,68.71 51.13,39.19 95.22,45.92 72.42,76.34 67.75,56.11 49.31,34.61 56.72,31.01 80.24,6.38 79.15,11.89 81.53,15.16 85.01,18.72 73.29,13.13 62.83,32.65 74.05,30.65 60.31,32.64 72.97,4.66 103.44,77.62 106.51,77.65 109.84,77.36 116.17,76.86 17.61,66.61 75.6,76.37 79.22,76.44 79.41,73.11 75.62,73.13 72.26,73.1 72.36,70.03 75.67,70.12 79.1,70.05 77.18,71.53 77.29,74.57 74.05,74.64 73.95,71.55 34.72,34.49 9.37,39.87 16.19,47.77 19.89,47.86 16.14,42.3 21.31,42.28 35.69,41.48 30.47,43.3 23.24,48.05 19,57 15.67,52.06 14.4,62.18 21.67,61.18 45.42,58.38 44.57,67.28 46.47,75.53 14.42,58.58 29.55,53.85
  pour Bottom: 0,85.09 160.02,85.09 160.02,0 69.85,0.03 70.1,30.48 19.39,30.61 19.09,0.09 0,0
  pour Top: 0,85.09 160.02,85.09 160.02,0 69.81,0.15 69.81,30.63 19.01,30.63 19.01,-0.36 0,0
  pour Bottom: 0,85.1 160.02,85.1 160.02,0.01 69.6,30.49 19.39,30.62 19.09,0.1 0,0.01
  pour Bottom: -0.05,85.59 159.97,85.59 159.97,0.5 69.8,0.01 70.05,30.47 18.76,30.37 19.01,-0.36 -0.05,0.5
  pour Bottom: 0,85.33 160.02,85.33 160.02,0.24 69.31,30.63 19.52,30.63 0,0.24
  pour Bottom: 0,85.09 160.02,85.09 160.02,0 69.81,30.63 19.52,30.63 19.09,0.09 0,0
GNDIO  (via drill 0.6)
  Top 0.406: U$16.2 68.52,27.86 67.78,28.59 66.77,28.59
  Bottom 0.406: 34.33,17.61 34.62,17.91 34.98,17.91
  other vias: 52.76,14.12 43.4,16.61 52.76,14.12 55.63,8.46 51.45,8 61.39,14.92 24.24,28.08 36.87,15.09 34.63,27.48 58.64,29.1 65.24,29.1
  pour Top: 21.05,29.61 68.29,29.61 68.45,-0.03 21.25,0.1
  pour Bottom: 21.05,29.61 68.53,29.59 68.52,0.03 21.27,0.13
LEDRX  (via drill 0.6)
  Top 0.254: v87.47,48.22 86.56,49.12 66.96,49.12 64.72,46.88 64.72,39.69 62.47,37.45 47.25,37.45 47.09,37.64 47.09,37.98 46.43,38.64 44.92,38.64 44.68,38.4 U13.15 | v95.98,39.96 97.63,39.96 98.27,40.61 98.27,49.66 100.31,51.7 113.11,51.7 115.34,49.46 115.34,44.01 v115.65,43.71 | v133.96,33.03 133.96,33.26 133.75,33.47 U6.31
  Bottom 0.254: v87.47,48.22 87.47,39.64 88.14,38.97 94.98,38.97 v95.98,39.96 | v115.65,43.71 121.91,43.71 122.9,42.72 122.9,34.58 123.86,33.61 133.38,33.61 v133.96,33.03
LEDTX  (via drill 0.5, 0.6)
  Top 0.254: v88.86,50.59 88.03,49.75 66.82,49.75 64.14,47.07 64.14,40 62.3,38.16 47.91,38.16 47.33,38.73 47.33,40.41 46.28,41.62 v39.84,41.62 | v96.47,41.89 96.48,50.06 99.07,52.71 112.92,52.71 116.09,49.54 116.09,47.37 v116.31,46.97 | v124.55,34.59 124.55,33.47 124.87,33.15 132.42,33.15 132.97,33.7 132.97,34.81 U6.30 | U13.2 38.18,38.4 v38.42,38.64
  Bottom 0.254: v88.86,50.59 88.86,40.51 89.45,39.92 94.05,39.92 95.3,41.18 96.03,41.18 v96.47,41.89 | v116.31,46.97 116.32,45.19 116.65,44.86 122.26,44.86 123.19,43.94 123.23,43.94 123.53,43.63 123.53,35.66 v124.55,34.59 | v38.42,38.64 38.42,41.15 38.83,41.56 39.79,41.56 v39.84,41.62
MCSRX
  Top 0.254: RX\.C 40.78,64.43 41.8,65.45 49.53,65.45 50.51,64.47 50.51,62.28 RS485.1
  Top 0.305: IC2.63 44.16,53.41 48.69,57.94 48.69,59.72 49.15,60.18 50.09,60.18 50.52,60.61 RS485.1
  Bottom 0.254: U2.2 49.37,80.36 50.52,79.38 50.7,62.43 RS485.1
MCSTX
  Top 0.254: TX\.C 42.97,63.94 43.47,64.45 47.86,64.45 47.99,64.31 RS485.2
  Top 0.305: RS485.2 47.99,58.19 43.71,53.92 IC2.64
  Bottom 0.305: U2.3 48.52,79.12 49.43,78.44 49.43,65.37 47.99,64.31 RS485.2
MISO-1  (via drill 0.6)
  Top 0.254: v14.56,48.42 14.86,48.64 15.2,48.9 21.53,48.9 IC2.22
  Bottom 0.254: ICSP.1 13.89,56.68 13.31,56.1 13.31,49.66 v14.56,48.42
MOSI-1
  Top 0.254: ICSP.4 12.07,51.62 14.29,49.4 21.52,49.4 IC2.21
N$1
  Top 0.305: TX.C 80.34,18.87 79.91,18.44 IC1.23
N$2
  Top 0.254: 13.A 18.68,45.36 R25.2
N$3
  Top 0.305: RX.C 82.5,18.64 81.64,17.78 78.73,17.78 IC1.22
N$4
  Top 0.305: R3.2 RX.A
N$5
  Top 0.254: CN1.D+ 75.2,12.34 75.5,12.64 76.8,12.64 77.38,13.23 78.68,13.23 IC1.15 81.53,13.25 82.26,12.52 82.26,11.53 82.62,11.17 83.95,11.17 JP10.2
N$6
  Top 0.254: IC2.34 27.54,44.29 28.67,43.16 28.67,40.68 OSS.3
N$7
  Top 0.254: IC2.33 27.04,44.35 25.72,43.03 25.72,40.72 OSS.1
N$8
  Top 0.254: CN1.D- 74.4,12.73 74.87,13.2 76.6,13.2 77.26,13.86 78.67,13.86 IC1.16 83.84,13.9 JP10.3
N$9
  Top 0.305: R4.2 80.37,24.65 TX.A
N$10
  Top 0.305: 5V\.A R10.2
N$11
  Top 0.305: IC1.1 71.46,27.97 JP1.1
N$12
  Top 0.305: IC1.17 76.37,14.55 75.84,14.02 73.71,14.02 73.61,14.12 73.61,19.51 73.36,19.76 | 73.36,19.76 71.47,19.76 IC1.4 | C6.1 73.98,20.39 73.36,19.76
N$13  (via drill 0.6)
  Top 0.254: v40.71,59.24 40.71,61.35 RX\.A
  Bottom 0.254: R2.1 40.78,60.09 40.72,60.03 40.72,59.25 v40.71,59.24
N$14  (via drill 0.6)
  Top 0.254: v43.03,59.29 43.03,61.33 TX\.A
  Bottom 0.254: R18.1 42.94,59.38 v43.03,59.29
N$16  (via drill 0.6)
  Top 0.254: 42.48,4.2 42.51,4.2 v42.88,4.57 | v41.51,18.73 40.57,18.73 40.3,18.46 U3.31 | U3.31
  Top 0.305: U4.3 21.59,17.65 20.89,16.95 20.89,12.58 21.83,11.64 21.83,4.08 23.69,2.23 40.54,2.23 42.46,4.15 42.48,4.15 42.48,4.2 42.51,4.22
  Bottom 0.254: v42.88,4.57 42.88,5.44 42.42,5.9 41.17,5.9 41.02,6.05 41.02,15.08 41.53,15.59 41.53,18.7 v41.51,18.73
N$17
  Top 0.305: 5V-SEN\.A 126.41,21.11 R11.2
N$18
  Top 0.305: JP5.1 41.43,28.52 U20.1
N$19  (via drill 0.6)
  Top 0.254: ISP1.3 29.16,9.7 29.34,9.53 29.34,8.76 29.67,8.43 31.98,8.43 32.31,8.76 32.31,10.85 31.95,11.2 31.95,12.15 U3.17 | R14.1 32.81,5.81 v32.28,5.23
  Bottom 0.254: v32.28,5.23 29.57,5.23 29.34,5.46 29.34,8.94 28.98,9.3 28.5,9.3 ISP1.3
N$20  (via drill 0.6)
  Top 0.254: U3.30 40.01,17.66 40.24,17.43 40.24,16.72 v40.51,16.44
  Top 0.305: U4.2 22.01,16.38 21.44,15.81 21.44,13 22.53,11.91 22.53,4.43 23.92,3.04 39.6,3.04 v41,4.44
  Bottom 0.254: v40.51,16.44 40.51,4.92 v41,4.44
N$21  (via drill 0.6)
  Top 0.254: R17.1 130.1,53.56 129.78,53.25 129.77,53.25 129.72,53.19 129.72,49.46 ISP2.3 | U6.17 127.45,43.5 v127.62,43.68
  Bottom 0.254: v127.62,43.68 127.62,47.37 ISP2.3
N$22
  Top 0.254: ISP2.4 127.46,50.68 127.12,50.34 127.12,46.39 127.55,45.96 129.14,45.96 129.74,45.35 U6.15
N$23
  Top 0.254: R17.2 133.12,53.56 133.68,53 133.68,50.75 LED2.A
N$24
  Top 0.254: U6.7 137.76,41.14 138.9,42.27 138.9,43.12 139.28,43.5 140.17,43.5 140.63,43.96 140.63,46.21 X2.1
N$25
  Top 0.254: U6.8 137.18,41.94 137.57,42.32 137.57,46.79 137.62,46.84 137.62,46.3 X2.3
N$26
  Top 0.305: R12.2 9V\.A
N$27
  Top 0.254: ISP1.4 27.97,7.16 26.8,8.33 26.8,11.79 27.23,12.22 28.6,12.22 28.96,12.57 28.96,14.07 29.34,14.45 U3.15
N$28
  Top 0.406: U8.7 143.21,22.84 143.6,22.45 146.29,22.45 R1.2 148.34,22.5 J3.2
N$29
  Top 0.406: J3.3 148.53,20.7 R1.1 142.8,20.7 141.92,21.57 141.92,24.1 U8.6
N$30
  Top 0.406: J5.2 148.6,43.07 R19.2 142.61,43.07 141.95,42.41 141.95,39.5 U9.7
N$31
  Top 0.406: U9.6 143.24,40.72 143.77,41.24 146.66,41.24 R19.1 148.23,41.27 J5.3
N$32
  Top 0.406: J6.2 149.94,65.03 147.26,65.03 146.39,64.17 R22.2 145.04,62.78 143.83,61.58 U10.7
N$33
  Top 0.254: R45.2 66.83,20.83 66.22,20.22 46.15,20.22 45.52,19.58 45.52,11.28 44.91,10.67 37.14,10.67 36.75,11.05 36.75,12.15 U3.23
N$34
  Top 0.406: U10.6 145.1,60.62 145.38,60.9 146.32,60.9 R22.1 148.99,60.98 J6.3
N$35
  Top 0.406: J7.2 137.22,74.22 138.57,72.87 138.57,71.51 R23.2 138.53,70.46 138.86,70.14 138.86,68.27 U11.7
N$36
  Top 0.406: J7.3 141.89,75.03 140.29,73.43 140.29,71.52 R23.1 140.4,71.4 140.4,70.34 140.16,70.1 U11.6
N$37
  Top 0.254: U6.32 136.63,34.84 137.3,34.17 137.3,31.01 138.05,30.26 U8.4
N$38
  Top 0.254: U6.1 143.16,36.34 144.54,34.96 144.54,33.36 U9.4
N$39  (via drill 0.6)
  Top 0.254: U10.4 146.37,48.53 v146,48.17 | v138.69,37.5 138.69,37.48 138.34,37.14 U6.2
  Bottom 0.254: v146,48.17 146,38.34 144.82,37.15 139.03,37.15 v138.69,37.5
N$40
  Top 0.813: T2.8 61.5,25.75 61.87,25.37 61.87,24.01 L2.2
N$41
  Top 0.254: U11.4 141.43,50.4 140.49,49.46 136.55,49.46 135.46,48.37 135.46,43.73 135.18,43.45 134.56,43.45 U6.9
N$42
  Top 0.305: LED1.A R14.2
N$43
  Top 0.305: R21.2 5V-LED\.A
N$44  (via drill 0.6)
  Top 0.305: v60.53,8.51 58.78,8.51 58.5,8.23 CG.C
  Bottom 0.305: R16.1 60.66,8.64 v60.53,8.51
N$45
  Bottom 0.406: 55.27,16.74 K1.5
  Bottom 0.813: JP12.1 52.91,7.47 54.23,8.79 54.23,16.33 54.69,16.79 55.32,16.79 K1.5
N$46
  Top 0.61: JP6.2 63.44,15.83 64.41,16.84 65.48,16.84 K1.1
N$47
  Top 0.254: U3.7 32.77,22.41 33.25,22.89 33.25,25.69 X4.1
N$48
  Top 0.254: X4.3 30.24,23.9 31.99,22.14 31.99,20.77 U3.8
N$49  (via drill 0.6)
  Top 0.305: v53.29,23.09 37.77,23.09 36.83,22.15 36.83,20.81 U3.2
  Bottom 0.305: U5.12 53.47,23.24 v53.29,23.09
N$50  (via drill 0.6)
  Top 0.305: v29.97,20.96 29.97,19.77 U3.9
  Bottom 0.305: U5.13 52.2,22.86 50.8,21.46 30.48,21.46 v29.97,20.96
N$51  (via drill 0.6)
  Top 0.305: v32.13,18.03 31.75,18.42 30.44,18.42 | 30.1,18.42 30.44,18.42 | 30.44,18.42 U3.10
  Bottom 0.305: U5.14 50.93,23.37 50.17,22.61 29.85,22.61 28.45,21.21 28.45,18.92 28.83,18.54 31.62,18.54 v32.13,18.03
N$52
  Top 0.254: LED8.A R29.1
N$53
  Top 0.254: U1.8 95.59,73.75 96.52,72.82 96.52,66.01 97.28,65.25 100.89,65.25 101.12,65.02 104.42,65.02 104.8,65.41 104.8,66.58 X1.3
N$54
  Top 0.305: U1.6 97.07,75.76 97.66,75.16 97.66,67.77 98.86,66.57 102.21,66.57 X1.1
N$55
  Top 0.305: U1.14 89.9,67.73 89.18,68.45 89.18,81.56 90.75,83.13 97.51,83.13 98.32,82.32 98.32,78.18 99.7,76.81 99.7,71.6 100.51,70.79 103.23,70.79 103.56,70.46 108.1,70.46 108.59,69.98 X1.6
N$56
  Top 0.254: U1.16 94.76,65.72 97.03,63.45 110.31,63.45 111.13,64.26 X1.8
N$57
  Top 0.254: U1.12 95.42,69.74 95.81,69.34 95.81,65.63 97.3,64.2 109.17,64.19 109.88,64.95 109.88,66.58 X1.7
N$58
  Top 0.305: U1.10 91.45,71.74 90.6,72.59 90.6,80.52 91.69,81.61 95.58,81.61 96.9,80.29 96.9,78.13 98.81,76.23 98.81,70.21 99.34,69.67 103.2,69.67 103.48,69.39 103.48,66.63 X1.2
N$59  (via drill 0.6)
  Top 0.61: v54.47,35.83 54.47,31.78 53.98,31.29 51.9,31.29 T2.3
  Bottom 0.61: CHG.3 53.59,48.29 53.98,47.9 53.98,36.33 v54.47,35.83
N$60
  Top 0.254: JP2.7 120.54,80.52 JP2.8 124.74,80.27 R8.1
N$61
  Top 0.254: X1.16 102.24,79.75 JP2.1
N$62
  Top 0.254: X1.14 104.78,79.49 JP2.2
N$63
  Top 0.254: X1.11 108.59,78.14 108.09,78.63 JP2.3
N$64
  Top 0.254: X1.9 111.13,77.35 112.09,78.32 114.92,78.32 115.72,79.12 115.72,80.26 JP2.6
N$65
  Top 0.254: 128.32,78.95 R9.2 R8.2 122.29,78.95 120.98,77.64 C9.2 | C9.2 | X1.15 103.51,72.3 103.96,71.84 109.69,71.84 | 109.69,71.84 116.47,71.84 118.33,73.69 120.93,73.69 C9.2 | X1.10 109.86,72 109.69,71.84
N$66  (via drill 0.6)
  Top 0.254: ELINK.A 87.99,33.5 v87.96,33.48
  Bottom 0.254: v87.96,33.48 87.96,31.53 R7.2
N$67  (via drill 0.6)
  Top 0.305: v93.26,33.8 93.26,34.74 93.52,35.01 95.03,35.01 EACT.A
  Bottom 0.305: R6.2 95.07,32.85 94.69,33.23 93.83,33.23 v93.26,33.8
N$68  (via drill 0.6)
  Top 0.254: WIFI.A v91.47,33.35
  Bottom 0.254: v91.47,33.35 91.47,31.53 R5.2
N$69  (via drill 0.6)
  Top 0.254: LED4.A 5.69,20.32 v5.44,20.57
  Bottom 0.254: v5.44,20.57 7.22,20.57 R35.1
N$70
  Top 0.254: U1.20 93.71,61.71 94.23,61.19 94.23,39.19 95.07,38.35 EACT.C
N$71  (via drill 0.6)
  Top 0.254: v12.4,20.67 10.39,20.67 LED3.A
  Bottom 0.254: R34.1 12.23,20.83 v12.4,20.67
N$72
  Top 0.254: JP2.4 112.92,80.27 JP2.5 113.17,82.07 113.78,82.68 127.22,82.66 127.94,82.01 127.92,81.16 R9.1
N$73
  Top 0.254: LED7.A 23.27,67.47 23.66,67.08 23.66,65.81 R28.1
N$74
  Top 0.305: R37.1 LED6.A
N$75
  Top 0.305: R36.1 LED5.A
N$76  (via drill 0.6)
  Top 0.305: v54.43,22.15 38.1,22.15 37.59,21.64 37.59,20.77 U3.1
  Bottom 0.305: U5.11 54.74,22.33 v54.43,22.15
N$77
  Top 0.254: R45.1 66.83,25.4 67.28,25.86 67.28,26.85 67.26,26.87 67.23,26.87 67.23,27.14 U$16.1
N$78  (via drill 0.6)
  Top 0.254: v43.54,11.61 39.47,11.61 38.89,12.19 37.6,12.19 U3.24
  Bottom 0.254: R46.2 44.18,12.26 v43.54,11.61
N$82  (via drill 0.6)
  Top 0.254: v67.46,19 66.35,19 65.89,18.82 64.87,18.42 62.1,18.42 61.34,18.82 49.4,18.82 48.36,17.58 48.36,15.27 v47.98,14.68
  Bottom 0.254: U$19.1 68.54,26.1 67.92,25.48 67.92,19.46 v67.46,19 | v47.98,14.68 45.91,14.68 R46.1
N$83  (via drill 0.6)
  Top 0.254: v42.02,13.07 39.17,13.08 39.07,13.18 U3.25
  Bottom 0.254: R44.2 42.65,18.49 42.29,17.86 42.29,13.49 v42.02,13.07
N$84  (via drill 0.5, 0.6)
  Top 0.254: v64.59,19.34 48.54,19.36 v47.73,18.47
  Bottom 0.254: U$18.1 65.44,20.2 v64.59,19.34 | v47.73,18.47 46.04,18.47 R44.1
N$85
  Top 0.254: R47.2 64.34,21.16 63.91,20.73 45.21,20.73 44.53,20.04 44.53,15.57 43.41,14.45 U3.26
N$86
  Top 0.254: R47.1 64.36,25.88 64.19,26.06 64.19,26.85 64.16,26.87 64.16,27.16 U$17.1
N$91
  Bottom 0.813: JP12.2 55.7,6.35 57.28,7.93 58.39,7.93 58.83,8.36 58.83,16.33 59.31,16.82 K1.3
N$109  (via drill 0.6)
  Top 0.305: JP1.2 74.78,26.47 v74.32,26.01 | v69.85,25.3 69.85,19.41 70.16,19.1 IC1.5
  Bottom 0.305: v74.32,26.01 70.56,26.01 v69.85,25.3
PIC13  (via drill 0.6)
  Top 0.254: v48.12,72.59 48.12,78.89 49.07,79.74 54.75,79.74 55.5,78.99 55.5,74.91 v55.32,74.73
  Bottom 0.254: JP7.9 24.23,70.66 24.74,70.15 24.74,67.55 26.56,65.73 45.91,65.73 47.42,67.23 47.42,71.86 v48.12,72.59 | v55.32,74.73 55.32,41.36 56.35,40.33 56.35,34.88 55.87,34.4 55.32,34.4 54.7,33.78 54.7,32.81 U5.6
PN13  (via drill 0.6)
  Top 0.254: R25.1 23.53,45.4 IC2.26 23.54,44.23 23.29,43.99 13.3,43.99 v12.66,44.74 | v12.5,24.63 15.7,24.63 v16.51,25.44
  Bottom 0.254: v12.66,44.74 12.78,44.53 13.48,43.83 13.48,35.54 12.9,34.97 6.31,34.97 5.53,34.18 5.53,25.83 6.66,24.7 12.43,24.7 v12.5,24.63 | v16.51,25.44 16.51,30.66 17.3,31.45 37.72,31.45 38.09,31.08 38.09,31.07 38.41,30.75 50.19,30.75 50.97,31.53 50.97,32.73 U5.3
PROG  (via drill 0.6)
  Top 0.305: U7.5 58.66,11.08 58.85,11.28 61.42,11.28 61.85,11.71 61.85,13.49 62.36,14 62.36,16.99 v62.69,17.5
  Bottom 0.305: v62.69,17.5 62.69,12.24 63.27,11.66 64.5,11.66 R20.2
RSA  (via drill 0.6)
  Top 0.305: v36.4,79.2 36.4,77.04 35.82,76.46 14.66,76.46 13.96,75.76 13.96,74.85 JP7.2
  Bottom 0.305: U2.8 38.17,81.66 37.26,80.75 37.26,80.07 v36.4,79.2
RSB
  Bottom 0.254: U2.7 39.22,80.39 36.53,77.69 21.71,77.69 20.91,76.89 17.46,76.89 16.63,76.05 16.63,74.75 JP7.4
RSY
  Bottom 0.254: U2.5 38.36,77.85 37.06,76.55 22.49,76.55 21.62,75.67 21.62,74.81 JP7.8
RSZ
  Bottom 0.254: U2.6 38.85,79.12 36.83,77.1 21.9,77.1 21.12,76.32 19.67,76.32 19.18,75.83 19.18,74.76 JP7.6
RX2  (via drill 0.6)
  Top 0.254: LED3.C 10.12,26.65 UART2.2 10.07,28.21 10.47,28.61 15.48,28.61 16.21,29.33 16.21,36.2 v17.29,37.28 | U13.13 45.04,37.1 v45.59,37.65 | v18.33,54.55 19.7,54.55 20.32,53.93 21.52,53.93 IC2.12
  Bottom 0.254: v45.59,37.65 18.01,37.65 17.91,37.75 | 17.91,37.75 17.62,38.04 17.62,53.84 v18.33,54.55 | v17.29,37.28 17.44,37.28 17.91,37.75
RXD0
  Top 0.254: IC2.3 17.82,58.41 15.94,60.36 15.94,64.28 UART0.1 16.61,64.92 16.61,67.35 | JP7.3 16.61,67.35 | LED8.C 16.52,67.27 16.61,67.35
RXD1  (via drill 0.6)
  Top 0.254: IC2.45 33.04,43.25 33.73,42.55 46.76,42.54 47.93,43.64 47.93,51.44 48.57,52.08 53.07,52.08 v53.77,51.38 | v52.88,67.01 50.93,67.01 50.29,67.65 LED5.C
  Bottom 0.254: U1.5 53.73,75.76 52.78,74.81 52.78,67.11 v52.88,67.01 53.77,66.12 v53.77,51.38 53.37,51.78 46.66,51.78 46.24,51.37 46.24,48.51 45.77,48.04 LAN.2
S0  (via drill 0.6)
  Top 0.254: U13.10 45.4,35.15 v45.67,34.88 | IC2.77 35.04,60.5 35.14,60.32 36.15,60.32 36.31,60.56 36.31,61.77 36.59,62.05 37.47,62.05 v37.49,62.07
  Bottom 0.254: v37.49,62.07 37.15,61.73 37.15,57.91 37.82,57.23 40.49,57.23 40.88,56.84 40.92,39.86 41.62,39.16 46.45,39.15 46.94,38.65 46.94,35.6 46.22,34.88 v45.67,34.88 45.59,34.8 R27.1
S1  (via drill 0.6)
  Top 0.254: U13.9 44.02,34.5 44.43,34.09 44.43,33.42 v44.76,33.09 | IC2.78 34.54,59.95 34.76,59.72 36.29,59.72 37.17,60.61 38.46,60.61 v38.66,60.81
  Bottom 0.254: v38.66,60.81 38.33,60.65 38.33,58.44 38.77,57.99 41.02,57.99 41.59,57.42 41.64,40.41 42.11,39.92 46.76,39.92 47.82,38.88 47.79,34.86 46.03,33.09 v44.76,33.09 43.83,32.16 R24.1
SCK-1
  Top 0.254: ICSP.3 12.99,56.68 13.32,56.34 13.32,51.35 14.77,49.91 21.53,49.91 IC2.20
SCL  (via drill 0.6)
  Top 0.254: IC2.43 32.04,40.12 v32.48,39.68 | v21.63,39.58 20.11,39.58 19.65,40.04 15.64,40.04 13.12,37.52 10.82,37.52 10.73,37.61 10.23,37.61 J8.2
  Top 0.406: JP3.1 5.08,39.7 7.24,37.54 10.15,37.54 J8.2
  Bottom 0.254: R40.2 9.6,38.16 J8.2 | v32.48,39.68 21.73,39.68 v21.63,39.58
SDA  (via drill 0.6)
  Top 0.254: IC2.44 32.54,42.12 v33.75,40.91 | v20.22,40.93 15.29,40.93 13.6,42.62 10.23,42.62 J8.3
  Top 0.406: J8.3 7.1,42.57 6.07,43.59 6.07,61.86 8.29,64.08 8.29,67.09 7.52,67.86 5.38,67.86 JP3.2
  Bottom 0.254: R41.2 9.9,42.86 J8.3 | v33.75,40.91 20.23,40.91 v20.22,40.93
STAT  (via drill 0.6)
  Top 0.305: U7.1 58.66,13.88 58.97,14.21 60.21,14.21 v60.48,13.88
  Bottom 0.305: v60.48,13.88 60.48,12.28 R16.2
TX2  (via drill 0.6)
  Top 0.254: LED4.C 7.53,22.43 UART2.3 7.53,28.67 8.45,29.59 15.04,29.59 15.56,30.11 15.56,38.18 16.41,39.03 v18.94,39.03 19.6,38.37 22.65,38.37 23.65,37.37 35.02,37.37 35.37,37.73 36.61,37.73 U13.3 | v19.14,52.94 19.38,52.94 19.84,53.4 21.52,53.4 IC2.13
  Bottom 0.254: v18.94,39.03 18.94,52.74 v19.14,52.94
TXD0
  Top 0.254: IC2.2 21.52,58.9 19.27,58.9 18.46,59.7 UART0.2 18.46,65.09 19.15,65.78 19.15,67.57 | 19.15,67.57 JP7.5 | LED7.C 19.25,67.47 19.15,67.57
TXD1
  Top 0.254: IC2.46 33.54,43.51 34.04,43.07 46.13,43.07 47.06,44 47.07,45.27 | 47.07,45.27 47.07,51.82 48.06,52.81 53.72,52.81 54.43,53.52 54.43,69.26 54.1,69.6 | LAN.3 46.84,45.5 47.07,45.27
  Top 0.305: U1.9 54.98,71.74 54.61,71.37 54.61,70.1 54.1,69.6 52.87,69.6 LED6.C
USBPR  (via drill 0.6)
  Top 0.254: IC1.20 83.78,16.5 JP10.4 | v71.06,11.88 73.17,11.88 73.6,11.45 CN1.VBUS | 73.6,9.37 CN1.VBUS | CN1.VBUS
  Top 0.305: v74.98,15.14 75.03,15.19 75.03,16.26 75.28,16.5 IC1.20 76.92,16.5 76.91,16.51 76.91,22 78.18,23.27 78.64,23.27 78.89,23.52 78.89,28.14 79.3,28.55 80.35,28.55 R4.1 R3.1
  Bottom 0.254: 71.5,14.25 71.5,12.32 v71.06,11.88
  Bottom 0.305: C5.1 74.26,17.92 C10.A 74.98,17.2 v74.98,15.14 74.93,15.09 72.34,15.09 71.5,14.25
V+  (via drill 0.6)
  Top 0.254: v33.6,18.82 33.6,19.81 33.55,19.86 33.55,20.73 U3.6 | 44.84,7.76 45.11,8.03 45.11,8.76 44.96,8.92 | U3.18 | U4.1 v23.28,12.86 23.28,6.41 24.88,4.81 30.02,4.81 30.7,5.48 30.7,6.57 30.77,6.65 30.77,7.02 ISP1.2
  Top 0.305: 32.92,7.67 32.51,7.26 32.47,7.23 | 46.99,8.28 v47.07,8.36 | v33.6,18.82 33.78,18.64 35,18.64 35.17,18.82 U3.4 35.17,23.53 v35.18,23.99 | v46.25,28.3 45.31,28.3 45.11,28.5 U20.5
  Top 0.406: U3.18 32.77,16.49 33.6,17.32 v33.6,18.82 33.63,18.8 | U3.18 32.77,11.3 33.12,10.95 33.12,9.32 33.17,9.27
  Top 0.61: 50.77,11.18 50.85,11.18 51,11.33 53.72,11.33 54,11.05 VREG.5 | v47.07,8.36 46.51,8.92 44.96,8.92 41.17,8.92 40.39,9.7 33.43,9.7 33.17,9.45 33.17,9.27 33.17,7.93 32.51,7.26 | 32.47,7.23 30.7,7.23 ISP1.2
  Top 0.813: 50.77,11.18 50.72,11.13 49.63,11.13 49.25,10.74 C23.+ 47.14,8.43 v47.07,8.36
  Bottom 0.254: C13.+ 35.75,19.08 33.86,19.08 v33.6,18.82 | 46.54,6.96 46.99,7.42 46.99,7.93 46.81,8.1 | 37.66,9.27 37.23,9.7 37.23,10.48 C14.1 | R13.2 23.46,23.62 23.81,23.26 23.81,20.68 22.99,19.86 22.99,13.15 v23.28,12.86 | U5.16 46.6,27.17 46.2,27.57 46.2,28.25 v46.25,28.3
  Bottom 0.305: 36.87,18.68 C13.+ | 46.81,8.1 v47.07,8.36 | v35.18,23.99 37.85,23.98 38.07,23.75 42.82,23.75 43.49,24.41 43.49,27.95 U20.5 46.04,28.51 v46.25,28.3 | C14.1 35.42,10.5 C12.+ 33.4,10.13 33.12,9.86 33.12,7.87 | 33.12,7.87 32.56,7.32 30.79,7.32 ISP1.2 | 33.2,7.95 33.12,7.87
  Bottom 0.406: C15.1 31.76,14.59 32.55,15.39 35.29,15.39 35.73,15.82 35.74,18.73 35.75,19.08
VBATT
  Top 0.61: K1.7 51.38,16.82 51.56,16.43 51.56,15.29 | 51.56,15.29 51.56,12.64 VREG.3 | VREG.1 54.01,14.01 | 54.01,14.01 53.98,14.91 53.11,15.29 51.56,15.29 | U7.3 56.76,13.96 56.69,14.02 54.02,14.02 54.01,14.01
  Bottom 0.254: 50.09,10.57 50.6,11.07 50.6,16.48 K1.7
VBUS  (via drill 0.6)
  Top 0.254: 56.79,9.8 56.79,10.07 U7.4
  Top 0.305: CG.A 57.69,4.94 57.46,5.18 57.46,9.14 56.79,9.8
  Top 0.61: v55.68,10.36 56.5,10.36 U7.4
  Top 0.813: L2.1 61.83,21.95 60.4,21.95 60.22,22.2 v60.22,24.23 60.1,24.36 51.05,24.36 50.57,24.84 JP4.1
  Bottom 0.305: C25.1 60.6,26.04 60.2,25.63 60.2,24.26 v60.22,24.23
  Bottom 0.61: v60.22,24.23 59.33,23.34 59.33,19.18 58.89,18.73 C11.1 57.56,17.58 57.28,17.27 57.28,15.95 56.87,15.55 56.87,11.33 56.79,11.25 55.91,11.25 55.68,11.02 v55.68,10.36
VRST  (via drill 0.6)
  Top 0.305: U3.29 35.33,16.86 v34.56,16.36
  Bottom 0.254: ISP1.5 25.55,16.36 25.59,16.4 26.62,17.42 26.62,22.12 S3.3
  Bottom 0.305: S3.3 26.64,24.64 | 26.64,24.64 S3.4 35.92,28.65 36.3,28.27 36.3,26.09 36.8,25.58 38.56,25.58 JP5.2 | v34.56,16.36 25.63,16.36 25.59,16.4 | R13.1 26.64,24.64
WDKICK  (via drill 0.6)
  Top 0.254: U20.4 44.05,24.71 43.58,24.24 37.06,24.24 35.78,25.52 35.78,28.33 35.5,28.61 29.2,28.61 28.56,27.97 28.56,16.11 27.88,15.42 26.65,15.42 26.37,15.15 26.37,13.35 v26.6,13.13
  Top 0.305: U3.16 30.48,9.86 ISP1.1
  Bottom 0.254: v26.6,13.13 26.6,12.02 26.99,11.63 30.4,11.63 30.48,11.55 30.48,9.86 ISP1.1
WDRX  (via drill 0.6)
  Top 0.254: U4.6 15.55,17.65 15.28,17.91 15.28,20 15.62,20.34 16.77,20.34 18.44,22.02 18.44,35.27 19.05,35.88 32.53,35.88 v33.03,35.38 | v40.72,36.75 40.72,37.43 41.04,37.75 U13.14
  Bottom 0.254: v33.03,35.38 38.97,35.38 39.31,35.72 39.31,36.8 39.57,37.07 40.4,37.07 v40.72,36.75
WDTX
  Top 0.254: U13.5 18.52,36.45 17.74,35.67 17.74,22.16 16.61,21.03 15.15,21.03 14.67,20.54 14.67,16.64 14.99,16.33 17.08,16.33 U4.7
WIFICONECT
  Top 0.254: 92.98,59.72 U1.22
  Top 0.305: U1.22 91.55,59.7 91.14,59.28 91.14,43.54 90.53,42.93 90.53,39.45 90.55,39.42 90.55,39.24 91.44,38.35 91.44,37.14 WIFI.C

## Text on the board
tPlace: RJ | + | + | The University of Akron | Lunabotics Main Board V 6.0
tNames: 1 | ACS !RESET
_tsilk: J1 | J7 | 1 | JP2 | U1 | 1 | R36 | R37 | 1 | +5 | +9 | gnd | R8 | R9 | C9 | + | + | JP7 | J6 | 1 | R23 | LED7 | + | LED8 | LED5 | LED6 | R29 | + | R28 | RX\ | TX\ | JP3 | U11 | UART0 | S2 | R22 | ICSP | + | + | RS485 | 1 | R17 | CHG | LAN | 1 | J5 | LED2 | U10 | RJ | 1 | ISP2 | X2 | 13 | + | IC2 | J4 | R15 | R25 | R19 | OSS | JP8 | DEBUG | T2 | WIFI | U9 | + | + | + | EACT | U6 | U13 | ELINK | R4 | R3 | 1 | J3 | 1 | J8 | C2 | C1 | JP5 | U20 | U8 | + | + | C3 | X4 | JP4 | C6 | R45 | C4 | + | R12 | + | + | + | ACS !RESET | S3 | L2 | RX | R21 | R10 | R11 | R47 | R1 | TX | + | + | R26 | U3 | + | 5V-LED\ | + | 9V\ | + | 5V\ | + | 5V-SEN\ | S1 | U4 | IC1 | ISP1 | K1 | 1 | 1 | 1 | 1 | 1 | U7 | VREG | LED1 | JP6 | CG | R14 | C23 | 5V-LED | 9V | 5V | 5V-SEN | + | + | The University of Akron | Lunabotics Main Board V 6.0
_bsilk: U2 | C20 | R2 | R18 | C19 | C18 | C17 | C16 | R41 | C7 | C8 | R40 | R27 | R24 | U5 | R7 | R5 | R6 | R13 | C25 | C10 | R34 | C13 | R35 | R44 | C11 | C5 | R46 | C12 | C14 | R16 | R20